# EAGLE design KGGR_UCCv2 (EAGLE 8.4.1)
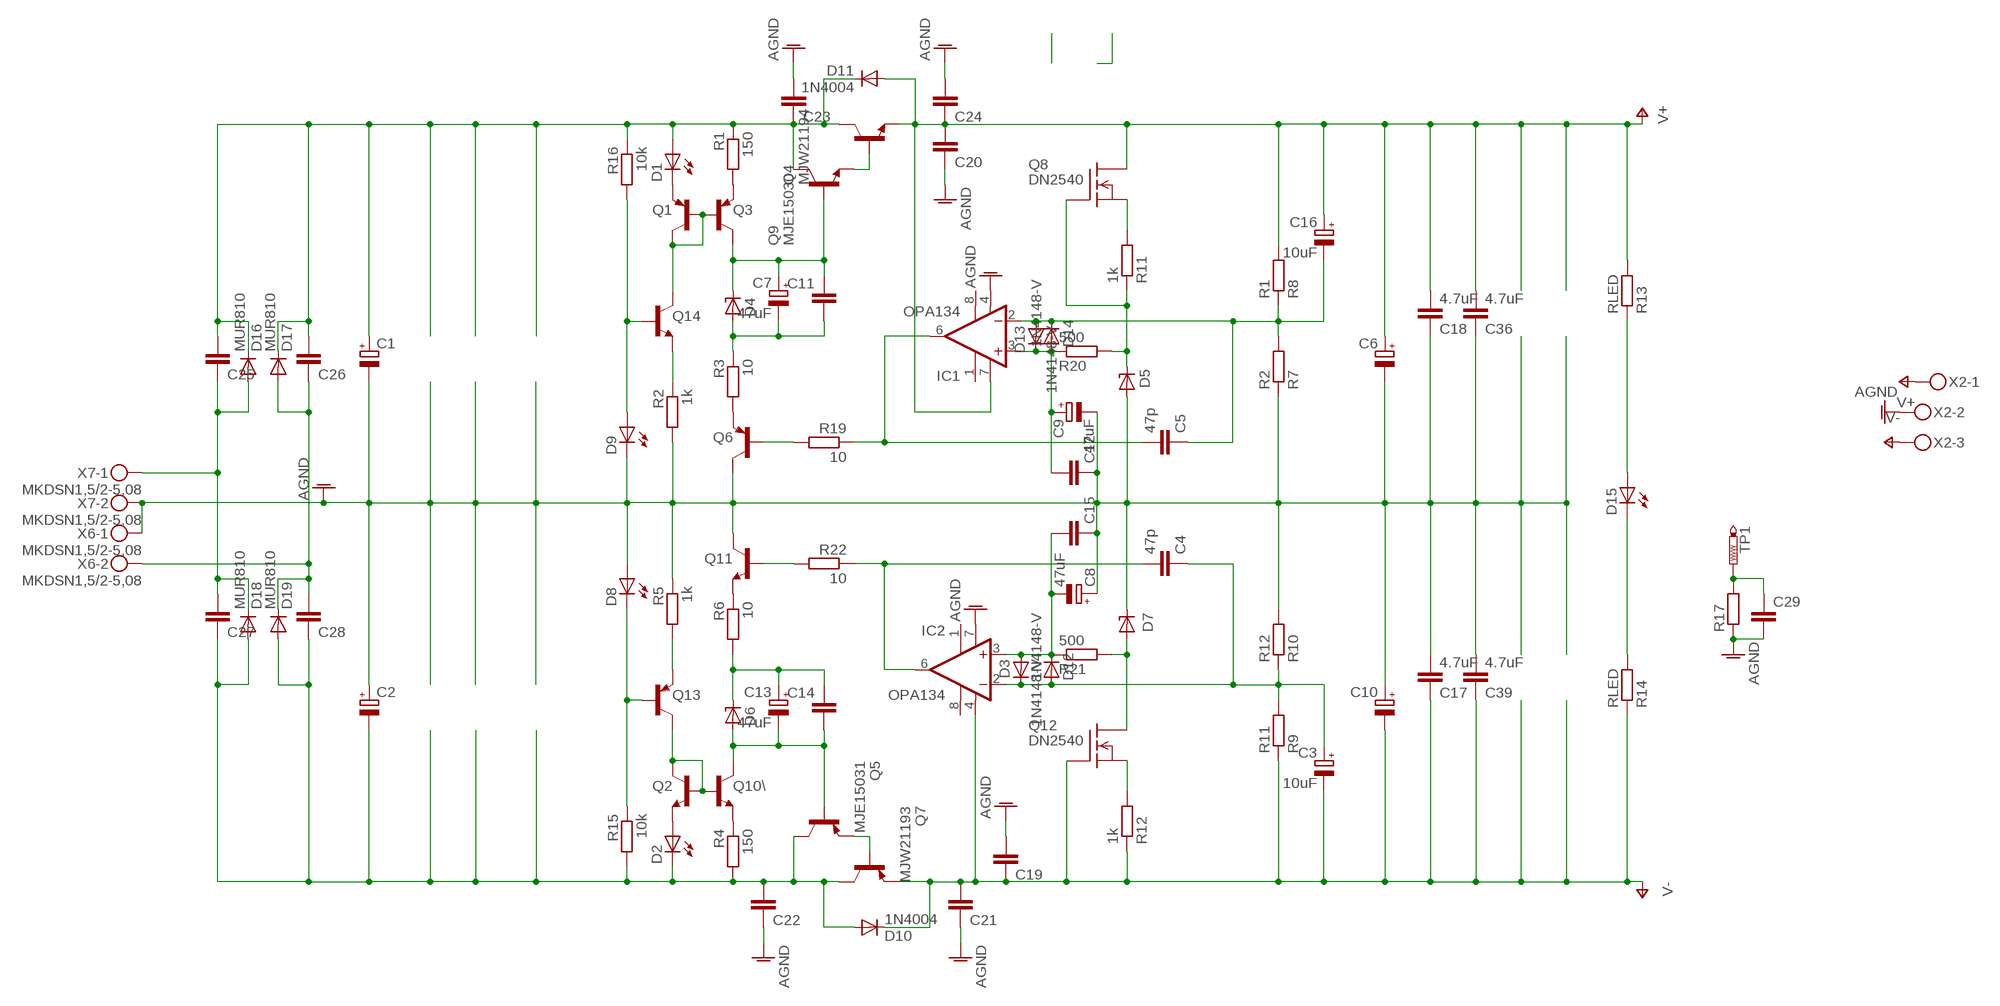
[diagram p0: schematic, sheet 1]

## Parts
C1  CPOL-EUE10-30  [EB30D]
C2  CPOL-EUE10-30  [EB30D]
C3  10uF  CPOL-EUSP-CAP-CX  [SP-CAP-CX]
C4  47p  C-EUC1206  [C1206]
C5  47p  C-EUC1206  [C1206]
C6  CPOL-EUE5-13  [E5-13]
C7  47uF  CPOL-EUSP-CAP-CX  [SP-CAP-CX]
C8  47uF  CPOL-EUSP-CAP-CX  [SP-CAP-CX]
C9  47uF  CPOL-EUSP-CAP-CX  [SP-CAP-CX]
C10  CPOL-EUE5-13  [E5-13]
C11  C-EUC1206  [C1206]
C12  C-EU050-035X075  [C050-035X075]
C13  47uF  CPOL-EUSP-CAP-CX  [SP-CAP-CX]
C14  C-EUC1206  [C1206]
C15  C-EU050-035X075  [C050-035X075]
C16  10uF  CPOL-EUSP-CAP-CX  [SP-CAP-CX]
C17  4.7uF  C-EUC1206  [C1206]
C18  4.7uF  C-EUC1206  [C1206]
C19  C-EU050-035X075  [C050-035X075]
C20  C-EU050-035X075  [C050-035X075]
C21  C-EU050-035X075  [C050-035X075]
C22  C-EU050-075X075  [C050-075X075]
C23  C-EU050-075X075  [C050-075X075]
C24  C-EU050-035X075  [C050-035X075]
C25  C-EU050-035X075  [C050-035X075]
C26  C-EU050-035X075  [C050-035X075]
C27  C-EU050-035X075  [C050-035X075]
C28  C-EU050-035X075  [C050-035X075]
C29  C-EU075-042X103  [C075-042X103]
C36  4.7uF  C-EUC1206  [C1206]
C39  4.7uF  C-EUC1206  [C1206]
D1  LED5MM  [LED5MM]
D2  LED5MM  [LED5MM]
D3  1N4148-V  [1N4148]
D4  1N4728  [DO41Z10]
D5  LT1021  LT1021-V  [DIL08]
D6  1N4728  [DO41Z10]
D7  LT1021  LT1021-V  [DIL08]
D8  LED5MM  [LED5MM]
D9  LED5MM  [LED5MM]
D10  1N4004  [DO41-10]
D11  1N4004  [DO41-10]
D12  1N4148-V  [1N4148]
D13  1N4148-V  [1N4148]
D14  1N4148-V  [1N4148]
D15  LED5MM  [LED5MM]
D16  MUR810  [TO220ACS]
D17  MUR810  [TO220ACS]
D18  MUR810  [TO220ACS]
D19  MUR810  [TO220ACS]
IC1  OPA134  OPA134P  [DIL08]
IC2  OPA134  OPA134P  [DIL08]
Q1  MPSA92-PNP-TO92-EBC  [TO92-EBC]
Q2  MPSA42-NPN-TO92-EBC  [TO92-EBC]
Q3  MPSA92-PNP-TO92-EBC  [TO92-EBC]
Q4  MJW21194  MJL4281  [TO-264]
Q5  MJE15031  [TO220KG]
Q6  MPSA92-PNP-TO92-EBC  [TO92-EBC]
Q7  MJW21193  MJL4302  [TO-264]
Q8  DN2540  2N7000TO92  [TO92-]
Q9  MJE15030  [TO220KG]
Q10\  MPSA42-NPN-TO92-EBC  [TO92-EBC]
Q11  MPSA42-NPN-TO92-EBC  [TO92-EBC]
Q12  DN2540  2N7000TO92  [TO92-]
Q13  MPSA92-PNP-TO92-EBC  [TO92-EBC]
Q14  MPSA42-NPN-TO92-EBC  [TO92-EBC]
R1  150  R-EU_0207/2V  [0207/2V]
R2  1k  R-EU_0207/2V  [0207/2V]
R3  10  R-EU_0207/2V  [0207/2V]
R4  150  R-EU_0207/2V  [0207/2V]
R5  1k  R-EU_0207/2V  [0207/2V]
R6  10  R-EU_0207/2V  [0207/2V]
R7  R2  R-EU_0207/2V  [0207/2V]
R8  R1  R-EU_0207/2V  [0207/2V]
R9  R11  R-EU_0207/2V  [0207/2V]
R10  R12  R-EU_0207/2V  [0207/2V]
R11  1k  R-EU_0207/2V  [0207/2V]
R12  1k  R-EU_0207/2V  [0207/2V]
R13  RLED  R-EU_0207/2V  [0207/2V]
R14  RLED  R-EU_0207/2V  [0207/2V]
R15  10k  R-EU_0207/2V  [0207/2V]
R16  10k  R-EU_0207/2V  [0207/2V]
R17  R-EU_0207/10  [0207/10]
R19  10  R-EU_0207/2V  [0207/2V]
R20  500  R-EU_0207/2V  [0207/2V]
R21  500  R-EU_0207/2V  [0207/2V]
R22  10  R-EU_0207/2V  [0207/2V]
TP1  PTR1PAD1-20  [P1-20]
X2  MKDSN1,5/3-5,08  [MKDSN1,5/3-5,08]
X6  MKDSN1,5/2-5,08  [MKDSN1,5/2-5,08]
X7  MKDSN1,5/2-5,08  [MKDSN1,5/2-5,08]

## Nets
AGND: C1.- C2.+ C6.- C8.+ C9.- C10.+ C12.1 C15.1 C17.2 C18.1 C19.2 C20.1 C21.1 C22.1 C23.2 C24.2 C29.2 C36.1 C39.2 D5.4(GND) D7.6(OUT) D8.A D9.K(C) IC1.4(V-) IC2.7(V+) Q6.C Q11.C R2.2 R5.1 R7.1 R10.2 R17.1 X2.2 X6.1 X7.2
N$1: Q1.B Q1.C Q3.B Q14.C
N$2: D1.K(C) Q1.E
N$3: Q3.E R1.2
N$4: C1.+ C23.1 C25.2 C26.2 D1.A D11.C D16.C D17.C Q4.C Q9.2(C) R1.1 R16.1
N$5: C7.+ C11.1 D4.C Q3.C Q9.1(B)
N$6: C7.- C11.2 D4.A R3.1
N$7: Q6.E R3.2
N$8: Q14.E R2.1
N$9: D9.A Q14.B R16.2
N$10: C8.- C15.2 D3.A D12.C IC2.3(+IN) R21.1
N$11: Q13.E R5.2
N$12: D8.K(C) Q13.B R15.1
N$13: Q11.E R6.1
N$14: C13.+ C14.1 D6.C R6.2
N$15: C13.- C14.2 D6.A Q5.1(B) Q10\.C
N$16: Q2.B Q2.C Q10\.B Q13.C
N$17: Q5.3(E) Q7.B
N$18: Q10\.E R4.1
N$19: D2.A Q2.E
N$21: Q4.B Q9.3(E)
N$22: C2.- C22.2 C27.1 C28.1 D2.K(C) D10.A D18.A D19.A Q5.2(C) Q7.C R4.2 R15.2
N$23: C25.1 C27.2 D16.A D18.C X7.1
N$24: C5.2 IC1.6(OUT) R19.1
N$25: C4.2 IC2.6(OUT) R22.1
N$26: Q11.B R22.2
N$27: Q6.B R19.2
N$28: C5.1 C16.- D13.A D14.C IC1.2(-IN) R7.2 R8.1
N$29: Q12.3(S) R12.2
N$30: D5.6(OUT) Q8.2(G) R11.1 R20.2
N$31: C9.+ C12.2 D13.C D14.A IC1.3(+IN) R20.1
N$32: D15.K(C) R14.2
N$33: D7.4(GND) Q12.1(D) R21.2
N$34: C3.+ C4.1 D3.C D12.A IC2.2(-IN) R9.2 R10.1
N$35: Q8.3(S) R11.2
N$36: D15.A R13.1
N$38: C26.1 C28.2 D17.A D19.C X6.2
N$43: C29.1 R17.2 TP1.TP
V+: C6.+ C16.+ C18.2 C20.2 C24.1 C36.2 D11.A IC1.7(V+) Q4.E Q8.1(D) R8.2 R13.2 X2.1
V-: C3.- C10.- C17.1 C19.1 C21.2 C39.1 D10.C IC2.4(V-) Q7.E Q12.2(G) R9.1 R12.1 R14.1 X2.3
Unconnected: IC1.1(TRIM1) IC1.8(TRIM2) IC2.1(TRIM1) IC2.8(TRIM2)

## Library data of the parts
C1-C3 C6-C10 C13 C16 = Vwvwbg:CPOL-EU: POLARIZED CAPACITOR, European symbol
C4 C5 C11 C12 C14 C15 C17-C29 C36 C39 = Vwvwbg:C-EU: CAPACITOR, European symbol
D1 D2 D8 D9 D15 = led:LED: LED OSRAM: - CHIPLED LG R971, LG N971, LY N971, LG Q971, LY Q971, LO R971, LY R971 LH N974, LH R974 LS Q976, LO Q976, LY Q976 LO Q996 - Hyper CHIPLED LW Q18S LB Q993, LB Q99A, LB R99A - SideLED LS A670, LO A670, LY A670, LG A670, LP A670 LB A673, LV A673, LT A673, LW A673 LH A674 LY A675 LS A676, LA A676, LO A676, LY A676, LW A676 LS A679, LY A679, LG A679 - Hyper Micro SIDELED® LS Y876, LA Y876, LO Y876, LY Y876 LT Y87S - SmartLED LW L88C, LW L88S LB L89C, LB L89S, LG L890 LS L89K, LO L89K, LY L89K LS L896, LA L896, LO L896, LY L896 - TOPLED LS T670, LO T670, LY T670, LG T670, LP T670 LSG T670, LSP T670, LSY T670, LOP T670, LYG T670 LG T671, LOG T671, LSG T671 LB T673, LV T673, LT T673, LW T673 LH T674 LS T676, LA T676, LO T676, LY T676, LB T676, LH T676, LSB T676, LW T676 LB T67C, LV T67C, LT T67C, LS T67K, LO T67K, LY T67K, LW E67C LS E67B, LA E67B, LO E67B, LY E67B, LB E67C, LV E67C, LT E67C LW T67C LS T679, LY T679, LG T679 LS T770, LO T770, LY T770, LG T770, LP T770 LB T773, LV T773, LT T773, LW T773 LH T774 LS E675, LA E675, LY E675, LS T675 LS T776, LA T776, LO T776, LY T776, LB T776 LHGB T686 LT T68C, LB T68C - Hyper Mini TOPLED® LB M676 - Mini TOPLED Santana® LG M470 LS M47K, LO M47K, LY M47K Source: http://www.osram.convergy.de LUXEON: - LUMILED® LXK2-PW12-R00, LXK2-PW12-S00, LXK2-PW14-U00, LXK2-PW14-V00 LXK2-PM12-R00, LXK2-PM12-S00, LXK2-PM14-U00 LXK2-PE12-Q00, LXK2-PE12-R00, LXK2-PE12-S00, LXK2-PE14-T00, LXK2-PE14-U00 LXK2-PB12-K00, LXK2-PB12-L00, LXK2-PB12-M00, LXK2-PB14-N00, LXK2-PB14-P00, LXK2-PB14-Q00 LXK2-PR12-L00, LXK2-PR12-M00, LXK2-PR14-Q00, LXK2-PR14-R00 LXK2-PD12-Q00, LXK2-PD12-R00, LXK2-PD12-S00 LXK2-PH12-R00, LXK2-PH12-S00 LXK2-PL12-P00, LXK2-PL12-Q00, LXK2-PL12-R00 Source: www.luxeon.com KINGBRIGHT: KA-3528ASYC Source: www.kingbright.com
D3 D12-D14 = diode:1N4148-V
D4 D6 = diode:1N4728: Z DIODE 3.3 V, 1W, 5 percent
D5 D7 = linear-technology:LT1021-V
D10 D11 = diode:1N4004: DIODE general purpose rectifier, 1 A
D16-D19 = diode:MUR810: DIODE
IC1 IC2 = burr-brown:OPA134: Operational Amplifiers SoundPlus(TM) High Performance Audio; MF: TEXAS INSTRUMENTS; MPN: OPA134PA; OC_FARNELL: 1335032; OC_NEWARK: 75C4599
Q1 Q3 Q6 Q13 = transistor:*-PNP-: PNP Transistror
Q2 Q10\ Q11 Q14 = transistor:*-NPN-: NPN Transistror BF959 corrected 2008.03.06
Q4 = TO264:MJL4281: MJL4281 NPN BCE TO-264
Q5 = transistor:MJE15031
Q7 = TO264:MJL4302: MJL4302 PNP BCE TO-264
Q8 Q12 = tranzistory FET:2N7000
Q9 = transistor:MJE15030
R1-R17 R19-R22 = Vwvwbg:R-EU_: RESISTOR, European symbol
TP1 = testpad:PTR1: TEST PIN
X2 = con-phoenix-508:MKDSN1,5/3-5,08: MKDSN 1,5/ 3-5,08 Printklemme Nennstrom: 13,5 A Nennspannung: 250 V Rastermaß: 5,08 mm Polzahl: 3 Anschlussart: Schraubanschluss Montage: Löten Anschlussrichtung Leiter/Platine: 0 ° Artikelnummer: 1729131 Source: http://eshop.phoenixcontact.com .. 1729131.pdf
X6 X7 = con-phoenix-508:MKDSN1,5/2-5,08: MKDSN 1,5/ 2-5,08 Printklemme Nennstrom: 13,5 A Nennspannung: 250 V Rastermaß: 5,08 mm Polzahl: 2 Anschlussart: Schraubanschluss Montage: Löten Anschlussrichtung Leiter/Platine: 0 ° Artikelnummer: 1729128 Source: http://eshop.phoenixcontact.com .. 1729128.pdf

## Board
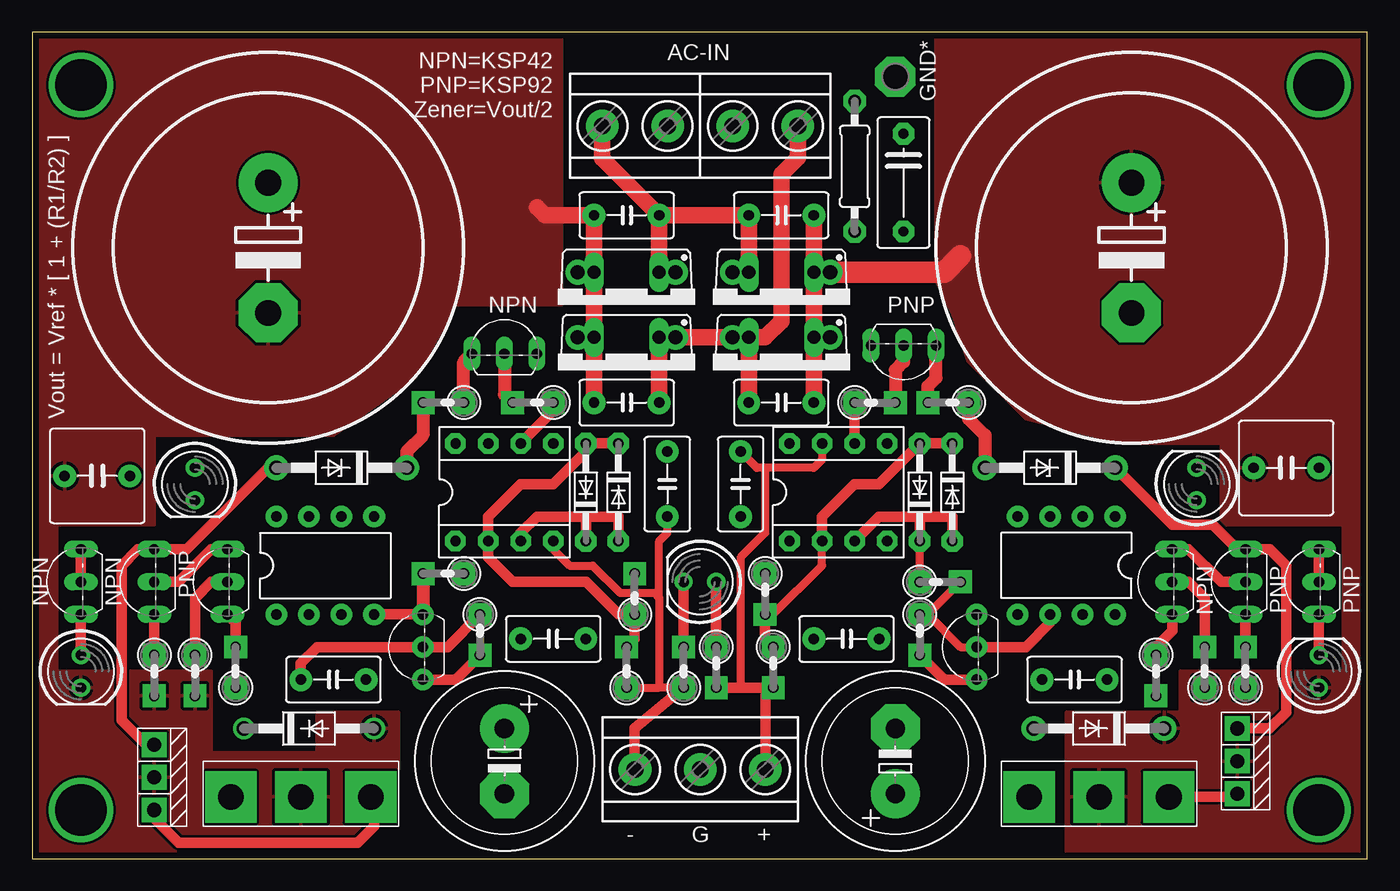
[diagram p1: board, top side]
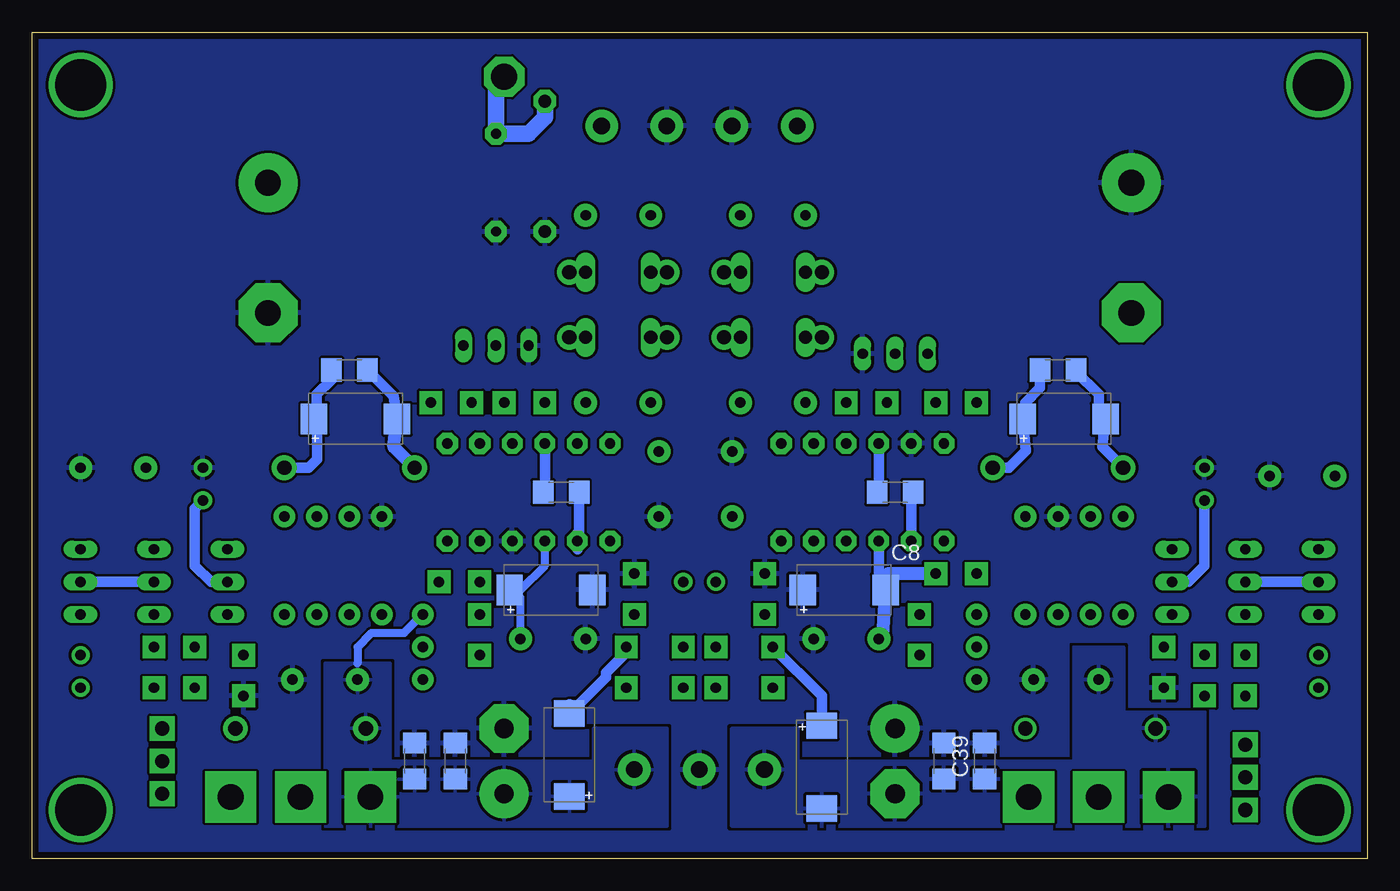
[diagram p2: board, bottom side, seen from below]

Size 104.12 x 64.44 mm. Coordinates in mm from the lower left corner, seen from the top.
Outline: 0,0 104.12,0 104.12,64.44 0,64.44 0,0
Copper layers (1*16): Top 0.035mm / dielectric 1.5mm / Bottom 0.035mm
Design rules "default *": minimum track width 10mil, minimum drill 24mil, track to track 8mil, track to pad 12mil, pad to pad 8mil, via to via 8mil, smd to smd 8mil, copper to edge 20mil, drill to drill 8mil, minimum pad ring 10mil, minimum via ring 8mil, stop-mask expansion 4mil, vias tented up to drill 0mil, thermal gap 10mil

### Footprints (pad centres in the part's own frame; a part is rotated, then mirrored left to right if it is on the bottom)
EB30D = drill 2.007 pad 4.597: + -5.08,0 | drill 2.007 pad 4.597 octagon: - 5.08,0
SP-CAP-CX = smd 2.062 x 2.4: + -2.754,0; - 3.707,0
C1206 = smd 1.6 x 1.8: 1 -1.4,0; 2 1.4,0
E5-13 = drill 1.5 pad 3.81: + -2.54,0 | drill 1.5 pad 3.81 octagon: - 2.54,0
C050-035X075 = drill 0.813 pad 1.778: 1 -2.54,0; 2 2.54,0
C050-075X075 = drill 0.813 pad 1.778: 1 -2.54,0; 2 2.54,0
C075-042X103 = drill 0.75 pad 1.676 octagon: 1 -3.81,0; 2 3.81,0
LED5MM = drill 0.813 pad 1.422: A -1.27,0; K 1.27,0
1N4148 = drill 0.813 pad 1.676 octagon: A 3.81,0; C -3.81,0
DO41Z10 = drill 1.118 pad 1.93: A 5.08,0; C -5.08,0
DIL08 = drill 0.813 pad 1.676: 1 -3.81,-3.81; 2 -1.27,-3.81; 3 1.27,-3.81; 4 3.81,-3.81; 5 3.81,3.81; 6 1.27,3.81; 7 -1.27,3.81; 8 -3.81,3.81
DO41-10 = drill 1.118: A 5.08,0; C -5.08,0
DO41-10' = drill 1.118 pad 1.93: A 5.08,0; C -5.08,0
TO220ACS = drill 1.016 long: A 2.54,-2.54; C -2.54,-2.54
DIL08' = drill 0.813 pad 1.6 octagon: 1 -3.81,-3.81; 2 -1.27,-3.81; 3 1.27,-3.81; 4 3.81,-3.81; 5 3.81,3.81; 6 1.27,3.81; 7 -1.27,3.81; 8 -3.81,3.81
TO92-EBC = drill 0.813 long: B 0,-1.27; C 2.54,-1.27; E -2.54,-1.27
TO-264 = drill 2 pad 4 square: B -5.45,-6.096; C 0,-6.096; E 5.45,-6.096
TO220KG = drill 1.1 pad 1.93 square: 1 -2.54,0; 2 0,0; 3 2.54,0
TO92- = drill 0.813 pad 1.676: 1 2.54,0; 2 0,0; 3 -2.54,0
0207/2V = drill 0.813 pad 1.778 square: 1 -1.27,0; 2 1.905,0
0207/10 = drill 1 pad 1.778 octagon: 1 -5.08,0; 2 5.08,0
P1-20 = drill 2.007 pad 3.15 octagon: TP 0,0
MKDSN1,5/3-5,08 = drill 1.3 pad 2.54: 1 -7.641,0.025; 2 -2.561,0.025; 3 2.519,0.025
MKDSN1,5/2-5,08 = drill 1.3 pad 2.54: 1 -2.561,0.025; 2 2.519,0.025

### Placement (x,y rotation side)
C1  85.72,47.62 270 top
C2  18.41,47.62 270 top
C3  42.55,7.62 270 bottom
C4  36.83,28.57 180 bottom
C5  62.87,28.57 180 bottom
C6  67.31,7.62 90 top
C7  79.38,34.29 0 bottom
C8  41.27,20.95 0 bottom
C9  64.14,20.95 0 bottom
C10  36.83,7.62 270 top
C11  79.38,38.1 0 bottom
C12  63.5,17.14 0 top
C13  24.13,34.29 0 bottom
C14  24.13,38.1 0 bottom
C15  40.64,17.14 180 top
C16  62.23,7.62 90 bottom
C17  33.02,7.62 90 bottom
C18  71.12,7.62 270 bottom
C19  49.53,29.21 90 top
C20  55.24,29.21 90 top
C21  23.5,13.97 180 top
C22  5.08,29.84 180 top
C23  97.79,30.48 0 top
C24  81.28,13.97 0 top
C25  58.42,35.56 0 top
C26  58.42,50.16 0 top
C27  46.35,35.56 0 top
C28  46.35,50.16 0 top
C29  67.94,52.7 270 top
C36  74.3,7.62 270 bottom
C39  29.84,7.62 90 bottom
D1  100.33,14.61 90 top
D2  3.81,14.61 270 top
D3  45.72,28.57 270 top
D4  79.38,30.48 180 top
D5  80.64,22.86 180 top
D6  24.13,30.48 180 top
D7  22.86,22.86 0 top
D8  12.7,29.21 270 top
D9  90.81,29.21 90 top
D10  21.59,10.16 0 top
D11  1N4004  [DO41-10']  83.19,10.16 180 top
D12  43.18,28.57 90 top
D13  69.22,28.57 90 top
D14  71.75,28.57 270 top
D15  52.07,21.59 180 top
D16  58.42,38.1 180 top
D17  58.42,43.18 180 top
D18  46.35,38.1 180 top
D19  46.35,43.18 180 top
IC1  OPA134  [DIL08']  62.87,28.57 0 top
IC2  OPA134  [DIL08']  36.83,28.57 0 top
Q1  99.06,21.59 90 top
Q2  2.54,21.59 90 top
Q3  93.34,21.59 90 top
Q4  83.19,-1.27 180 top
Q5  9.53,6.35 270 top
Q6  67.94,38.73 180 top
Q7  20.95,-1.27 180 top
Q8  73.66,16.51 90 top
Q9  93.98,7.62 270 top
Q10\  8.26,21.59 90 top
Q11  36.83,40.64 0 top
Q12  30.48,16.51 90 top
Q13  13.97,21.59 90 top
Q14  87.63,21.59 90 top
R1  94.61,14.61 90 top
R2  87.63,14.61 270 top
R3  71.75,35.56 180 top
R4  9.53,14.61 270 top
R5  15.88,14.61 90 top
R6  32.38,35.56 180 top
R7  57.15,20.95 270 top
R8  57.78,15.24 270 top
R9  46.35,14.61 90 top
R10  46.99,20.32 90 top
R11  69.22,17.78 270 top
R12  34.92,17.78 270 top
R13  53.34,15.24 270 top
R14  50.8,14.61 90 top
R15  12.7,14.61 270 top
R16  91.44,14.61 90 top
R17  64.14,53.98 90 top
R19  65.41,35.56 0 top
R20  70.48,21.59 0 top
R21  32.38,22.23 180 top
R22  39.37,35.56 180 top
TP1  67.31,60.96 0 top
X2  49.53,6.99 180 top
X6  46.99,57.15 180 top
X7  57.15,57.15 180 top

### Tracks (layer width: path | path; a pad name or v marks a point on that pad's centre or on a via)
AGND
  pour Bottom (rank 2): -3.81,68.58 115.57,68.58 115.57,0 -3.81,0
N$1
  Top 0.813: Q3.B 92.71,21.59 90.17,24.13 Q14.C | Q1.B Q1.C
  Bottom 0.813: Q1.B Q3.B
N$2
  Top 0.813: Q1.E D1.K
N$3
  Top 0.813: R1.2 Q3.E
N$4  (via drill 1.1 pad 1.93)
  Top 0.813: D16.C v62.23,40.64 | D17.C v62.23,45.72
  Top 1.27: C25.2 D16.C D17.C C26.2
  Top 1.676: v62.23,45.72 71.12,45.72 72.39,46.99
  pour Top: 80.64,0 80.64,11.43 89.53,11.43 89.53,14.61 102.23,14.61 102.23,26.04 92.71,26.04 92.71,32.38 85.09,32.38 77.47,34.29 73.03,38.73 71.75,42.55 70.48,45.09 70.48,64.77 109.22,64.77 109.22,0
N$5
  Top 0.813: Q9.1 96.52,10.16 97.79,11.43 97.79,22.86 96.52,24.13 Q3.C 93.98,24.13 92.08,26.04 88.9,26.04 D4.C
  Bottom 0.813: 81.88,33.66 C7.+ | 81.88,33.66 81.88,31.16 82.55,30.48 D4.C | C11.1 80.78,37.34 81.92,36.2 81.92,33.7 81.88,33.66
N$6
  Top 1.016: R3.1 73.03,34.29 74.3,33.02 D4.A
  Bottom 0.813: C7.- 75.92,36.05 C11.2
  Bottom 1.016: C7.- 75.92,32.11 D4.A
N$7
  Top 1.016: R3.2 69.85,36.83 70.48,37.47 Q6.E
N$8
  Top 0.813: Q14.E 88.9,17.78 87.63,16.51 R2.1
N$9
  Top 0.813: R16.2 91.44,20.32 90.17,21.59 Q14.B
  Bottom 0.813: D9.A 91.44,27.3 91.44,22.86 90.17,21.59 Q14.B
N$10
  Top 0.813: IC2.3 38.1,25.4 39.37,26.67 43.18,26.67 | 43.18,26.67 45.72,26.67 D3.A | D12.C 43.18,26.67
  Bottom 0.813: IC2.3 38.1,22.27 37.96,21.62 C8.-
  Bottom 1.016: C8.- 37.82,17.42 C15.2 | R21.1 37.36,22.23 37.96,21.62
N$11
  Top 0.813: R5.2 15.88,18.41 Q13.E
N$12
  Top 0.813: R15.1 12.7,20.32 13.97,21.59 Q13.B
  Bottom 0.813: D8.K 12.7,22.86 13.97,21.59 Q13.B
N$13
  Top 1.016: R6.1 33.66,38.73 Q11.E
N$14
  Top 1.016: R6.2 30.48,33.02 29.21,31.75 D6.C
  Bottom 0.813: D6.C 27.94,30.48 26.63,31.79 C13.+ 26.67,34.33 26.67,35.56 25.53,36.7 C14.1
N$15
  Top 0.813: Q5.1 8.89,8.89 6.99,10.79 6.99,22.86 8.26,24.13 Q10\.C 12.06,24.13 18.41,30.48 D6.A
  Bottom 0.813: D6.A 20.68,32.11 C13.- 20.95,34.57 20.95,36.2 22.73,37.97 C14.2
N$16
  Top 0.813: Q10\.B 11.43,21.59 13.97,24.13 Q13.C | Q2.B Q2.C
  Bottom 0.813: Q2.B Q10\.B
N$17
  Top 0.813: Q7.B 26.67,4.56 26.67,2.54 25.4,1.27 11.43,1.27 9.53,3.17 Q5.3
N$18
  Top 0.813: R4.1 Q10\.E
N$19
  Top 0.813: Q2.E D2.A
N$20  (via drill 4)
  other vias: 3.81,3.81
N$21
  Top 0.813: Q4.B 93.73,4.83 Q9.3
N$22  (via drill 1.1 pad 1.93)
  Top 0.813: v42.55,40.64 D18.A | v42.55,45.72 D19.A
  Top 1.27: C27.1 D18.A D19.A C28.1 40.01,50.16 39.37,50.8
  pour Top: 28.57,0 28.57,11.43 22.23,11.43 22.23,8.26 13.97,8.26 13.97,14.61 1.91,14.61 1.91,26.04 9.53,26.04 9.53,33.02 23.5,33.02 29.84,37.47 33.02,43.18 41.27,43.18 41.27,67.31 -3.81,67.31 -3.81,0
N$23  (via drill 1.1 pad 1.93)
  Top 1.27: C27.2 D18.C v50.16,40.64 v54.61,40.64 D16.A | C25.1 D16.A | X7.1 59.71,54.63 58.42,53.34 58.42,41.91 57.15,40.64 D16.A
N$24
  Top 0.813: IC1.6 R19.1
  Bottom 0.813: IC1.6 64.14,28.7 C5.2
N$25
  Top 0.813: R22.1 40.64,34.92 IC2.6
  Bottom 0.813: IC2.6 38.1,28.7 C4.2
N$26
  Top 1.016: Q11.B 36.83,36.2 R22.2
N$27
  Top 1.016: Q6.B 67.94,38.73 67.31,38.1 R19.2
N$28
  Top 0.61: R7.2 57.78,19.05 61.59,22.86 IC1.2
  Top 0.813: D14.C D13.A 66.04,29.21 64.14,29.21 61.59,26.67 IC1.2 | R8.1 57.15,17.14 R7.2
  Bottom 0.813: 62.23,12.06 C16.- 59.38,14.17 59.38,14.52 57.78,16.12 R8.1 | C5.1 61.47,25.53 61.59,25.4 IC1.2 61.59,24.13
N$29
  Top 0.813: Q12.3 33.02,13.97 R12.2
N$30
  Top 0.61: 69.85,19.05 R11.1 69.85,19.05 | Q8.2 72.39,16.51 69.85,19.05 | 69.85,19.05 R20.2
  Top 0.813: Q8.2 77.47,16.51 79.38,18.41 D5.6
N$31
  Top 0.61: R20.1 D13.C
  Top 0.813: IC1.3 66.04,26.67 69.22,26.67 | 69.22,26.67 71.75,26.67 D14.A | D13.C 69.22,26.67
  Bottom 0.61: C12.2 66.04,20.36 C9.+ 66.04,20.95 64.14,22.86 IC1.3
N$32
  Top 0.813: D15.K R14.2
N$33
  Top 0.813: Q12.1 D7.4
  Top 1.016: R21.2 Q12.1
N$34
  Top 0.813: D3.C D12.A 43.18,31.75 40.64,29.21 38.1,29.21 35.56,26.67 IC2.2 35.56,23.5 37.47,21.59 43.18,21.59 45.72,19.05 R10.1 46.99,17.14 R9.2
  Bottom 0.813: IC2.2 35.56,28.45 C4.1 | 42.55,12.06 C3.+ 42.55,12.7 R9.2
N$35
  Top 0.813: R11.2 71.12,13.97 Q8.3
N$36
  Top 0.813: R13.1 D15.A
N$37  (via drill 4)
  other vias: 3.81,60.33
N$38  (via drill 1.1 pad 1.93)
  Top 0.813: v54.61,45.72 D17.A | v50.16,45.72 D19.C
  Top 1.27: D19.C C28.2 | C28.2 C26.1 D17.A | C28.2 44.45,54.61 44.45,57.1 X6.2
N$39  (via drill 4)
  other vias: 100.33,3.81
N$40  (via drill 4)
  other vias: 100.33,60.33
N$43
  Bottom 1.27: R17.2 64.14,57.78 65.41,56.52 C29.1 67.94,60.33 TP1.TP
V+
  Top 0.61: IC1.7 61.59,31.11 60.96,30.48 57.15,30.48 | 57.15,30.48 56.52,30.48 C20.2 | 57.15,30.48 57.15,25.4 55.24,23.5 55.24,13.34
  Top 0.813: R13.2 55.24,13.34 R8.2 57.17,12.72 X2.1 57.15,7.62
  Bottom 0.61: 78.74,15.24 78.74,16.51 77.65,17.6 75.11,17.6 Q8.1
  pour Bottom: 54.61,10.16 54.61,2.54 81.28,2.54 81.28,15.24 76.2,15.24 76.2,7.62 60.33,7.62 60.33,10.16
V-
  Top 0.61: IC2.4 40.64,24.13 41.91,22.86 43.72,22.86 45.85,20.73 48.49,20.73 48.9,20.32 | C19.1 49.53,25.4 48.9,24.77 48.9,20.32 | R9.1 48.9,13.34 | R14.1 48.9,13.34 | 48.9,20.32 48.9,13.34
  Top 0.813: R14.1 46.99,10.16 46.99,7.62 X2.3 | C21.2 20.95,15.24 22.23,16.51 Q12.2 32.38,16.51 R12.1
  pour Bottom: 12.7,2.54 49.53,2.54 49.53,10.16 44.45,10.16 44.45,7.62 22.86,7.62 22.86,16.51 19.05,16.51 19.05,11.43 12.7,11.43

### Text on the board
tPlace: NPN=KSP42 / PNP=KSP92 / Zener=Vout/2 | AC-IN | GND* | NPN | PNP | Vout = Vref * [ 1 + (R1/R2) ] | NPN | PNP | PNP | NPN | NPN | PNP | -
tNames: G | +